# EAGLE design Adaptador_ESP12 (EAGLE 6.5.0)
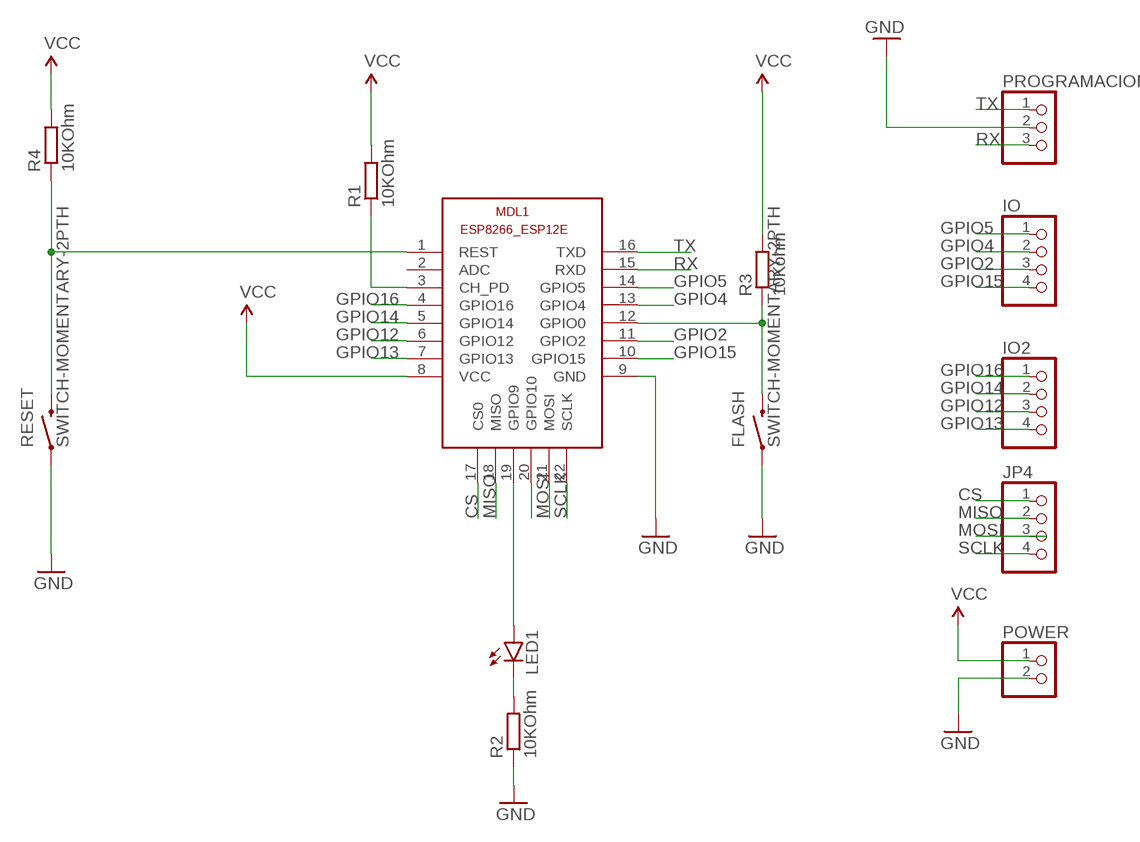
[diagram p0: schematic, sheet 1]

## Parts
FLASH  SWITCH-MOMENTARY-2PTH  [TACTILE-PTH]
IO  PINHD-1X4  [1X04]
IO2  PINHD-1X4  [1X04]
JP4  PINHD-1X4  [1X04]
LED1  LED-3MM-NO_SILK  [LED3MM-NS]
MDL1  ESP8266-12EESP8266-ESP12E  [ESP8266-ESP12E]
POWER  PINHD-1X2  [1X02]
PROGRAMACION  PINHD-1X3  [1X03]
R1  10KOhm  R-EU_0207/7  [0207/7]
R2  10KOhm  R-EU_0207/7  [0207/7]
R3  10Kohm  R-EU_0207/7  [0207/7]
R4  10KOhm  R-EU_0207/7  [0207/7]
RESET  SWITCH-MOMENTARY-2PTH  [TACTILE-PTH]

## Nets
CS: JP4.1 MDL1.17(CS0)
GND: FLASH.1 MDL1.9(GND) POWER.2 PROGRAMACION.2 R2.1 RESET.1
GPIO2: IO.3 MDL1.11(GPIO2)
GPIO4: IO.2 MDL1.13(GPIO4)
GPIO5: IO.1 MDL1.14(GPIO5)
GPIO12: IO2.3 MDL1.6(GPIO12)
GPIO13: IO2.4 MDL1.7(GPIO13)
GPIO14: IO2.2 MDL1.5(GPIO14)
GPIO15: IO.4 MDL1.10(GPIO15)
GPIO16: IO2.1 MDL1.4(GPIO16)
MISO: JP4.2 MDL1.18(MISO)
MOSI: MDL1.21(MOSI)
N$1: FLASH.3 MDL1.12(GPIO0) R3.1
N$2: MDL1.1(REST) R4.1 RESET.3
N$3: MDL1.3(CH_PD) R1.1
N$4: LED1.K(C) R2.2
N$10: MDL1.20(GPIO10)
N$11: LED1.A MDL1.19(GPIO9)
RX: MDL1.15(RXD) PROGRAMACION.3
SCLK: JP4.4 MDL1.22(SCLK)
TX: MDL1.16(TXD) PROGRAMACION.1
VCC: MDL1.8(VCC) POWER.1 R1.2 R3.2 R4.2
Unconnected: JP4.3 MDL1.2(ADC)

## Library data of the parts
FLASH RESET = SparkFun-Electromechanical:SWITCH-MOMENTARY-2: Various NO switches- pushbuttons, reed, etc
IO IO2 JP4 = pinhead:PINHD-1X4: PIN HEADER
LED1 = SparkFun-LED:LED: LEDs Standard schematic elements and footprints for 5mm, 3mm, 1206, and 0603 sized LEDs. 5mm - Spark Fun Electronics SKU : COM-00529 (and others)
MDL1 = ESP8266-ESP12E:ESP8266-12E: ESP8266-12E with additional I/O and GPIO04/05 corrected The author cannot warrant that this library is free from error or will meet your specific requirements. Created by PuceBaboon.com. Komagane, Nagano, JAPAN
POWER = pinhead:PINHD-1X2: PIN HEADER
PROGRAMACION = pinhead:PINHD-1X3: PIN HEADER
R1-R4 = rcl:R-EU_: RESISTOR, European symbol

## Board
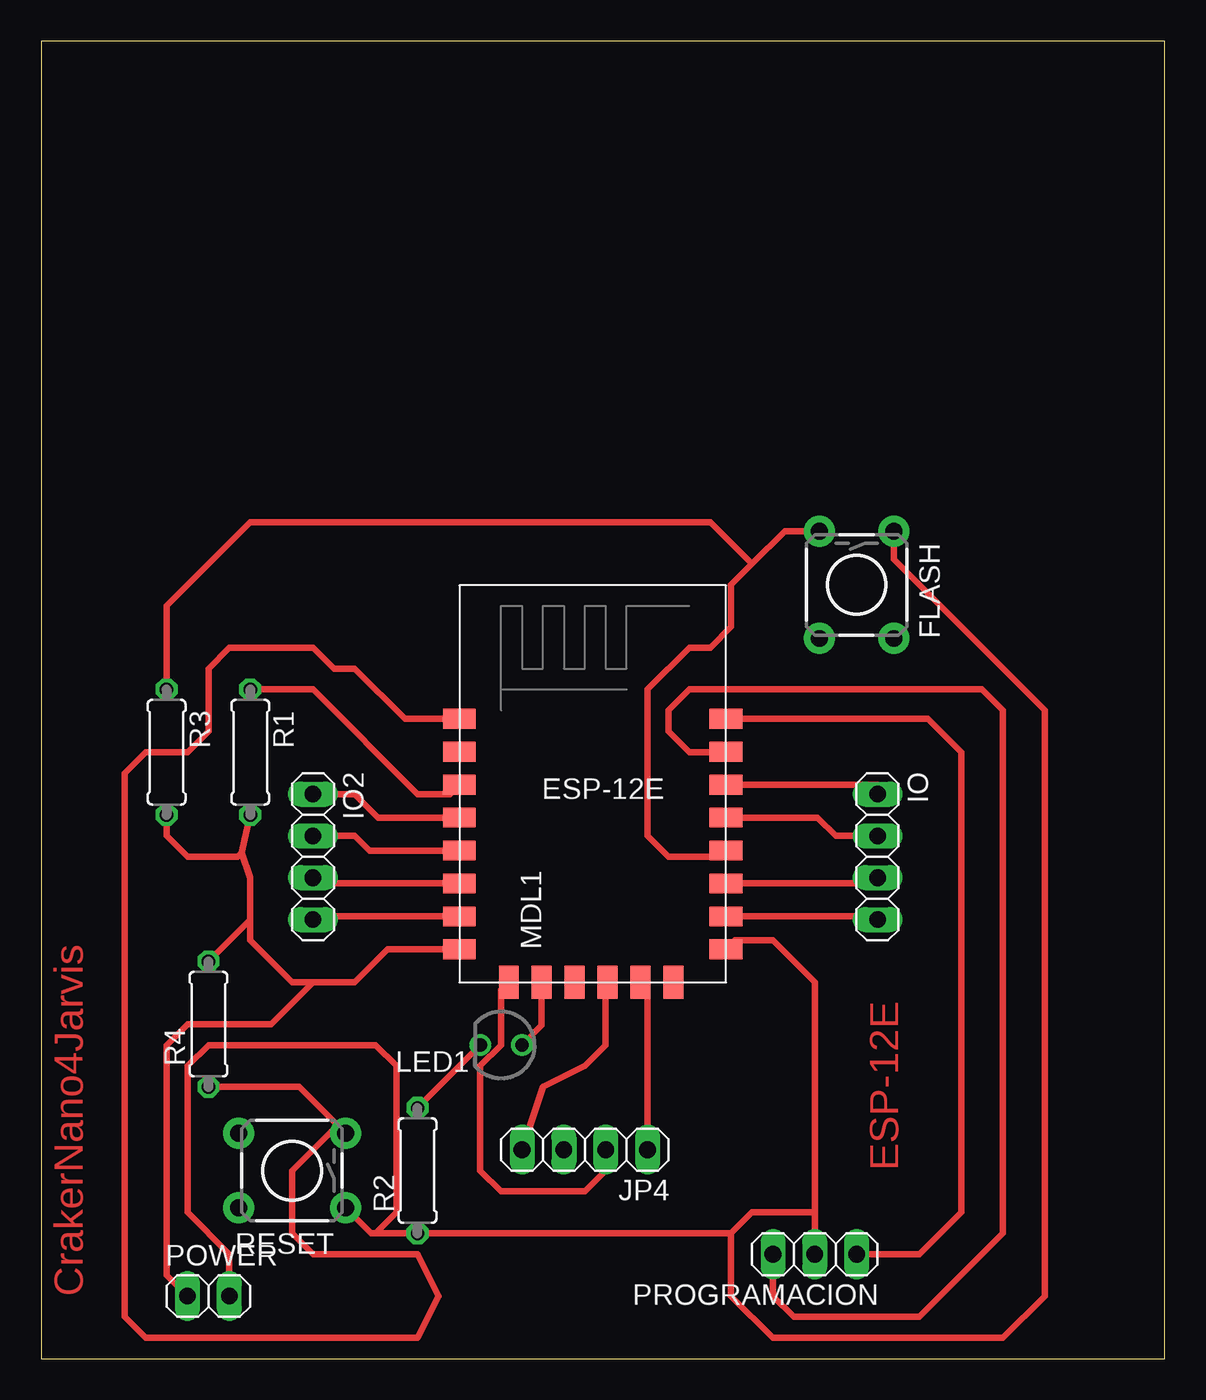
[diagram p1: board, top side]

Size 68.25 x 80 mm. Coordinates in mm from the lower left corner, seen from the top.
Outline: 0,0 68.25,0 68.25,80 0,80 0,0
Copper layers (1*16): Top 0.035mm / dielectric 1.5mm / Bottom 0.035mm
Design rules "default": minimum track width 10mil, minimum drill 24mil, track to track 8mil, track to pad 8mil, pad to pad 8mil, via to via 8mil, smd to smd 8mil, copper to edge 40mil, drill to drill 8mil, minimum pad ring 10mil, minimum via ring 8mil, stop-mask expansion 4mil, vias tented up to drill 0mil, thermal gap 10mil

### Footprints (pad centres in the part's own frame; a part is rotated, then mirrored left to right if it is on the bottom)
TACTILE-PTH = drill 1.016 pad 1.88: 1 -3.251,2.261; 2 3.251,2.261; 3 -3.251,-2.261; 4 3.251,-2.261
1X04 = drill 1.016 long: 1 -3.81,0; 2 -1.27,0; 3 1.27,0; 4 3.81,0
LED3MM-NS = drill 0.813: A -1.27,0; K 1.27,0
ESP8266-ESP12E = smd 2 x 1.2: 1 0,16; 2 0,14; 3 0,12; 4 0,10; 5 0,8; 6 0,6; 7 0,4; 8 0,2; 9 16.2,2; 10 16.2,4; 11 16.2,6; 12 16.2,8; 13 16.2,10; 14 16.2,12; 15 16.2,14; 16 16.2,16 | smd 1.2 x 2: 17 11,0; 18 3,0; 19 5,0; 20 13,0; 21 7,0; 22 9,0
1X02 = drill 1.016 long: 1 -1.27,0; 2 1.27,0
1X03 = drill 1.016 long: 1 -2.54,0; 2 0,0; 3 2.54,0
0207/7 = drill 0.813 octagon: 1 -3.81,0; 2 3.81,0

### Placement (x,y rotation side)
FLASH  49.53,46.99 270 top
IO  50.8,30.48 270 top
IO2  16.51,30.48 270 top
JP4  33.02,12.7 180 top
LED1  27.94,19.05 180 top
MDL1  25.4,22.86 0 top
POWER  10.16,3.81 0 top
PROGRAMACION  46.99,6.35 180 top
R1  12.7,36.83 270 top
R2  22.86,11.43 90 top
R3  7.62,36.83 270 top
R4  10.16,20.32 90 top
RESET  15.24,11.43 180 top

### Tracks (layer width: path | path; a pad name or v marks a point on that pad's centre or on a via)
CS
  Top 0.406: JP4.1 36.83,22.43 MDL1.17
GND
  Top 0.406: PROGRAMACION.2 46.99,8.89 | 46.99,8.89 46.99,22.86 44.45,25.4 42.14,25.4 MDL1.9 | FLASH.1 51.79,48.54 60.96,39.37 60.96,3.81 58.42,1.27 44.45,1.27 41.91,3.81 41.91,7.62 | 41.91,7.62 43.18,8.89 46.99,8.89 | 20.32,7.62 R2.1 41.91,7.62 | 20.32,7.62 20.04,7.62 RESET.1 | POWER.2 11.43,6.35 8.89,8.89 8.89,17.78 10.16,19.05 20.32,19.05 21.59,17.78 21.59,8.89 20.32,7.62
GPIO2
  Top 0.406: MDL1.11 50.45,28.86 IO.3
GPIO4
  Top 0.406: MDL1.13 47.15,32.86 48.26,31.75 IO.2
GPIO5
  Top 0.406: MDL1.14 50.8,34.86 IO.1
GPIO12
  Top 0.406: MDL1.6 16.86,28.86 IO2.3
GPIO13
  Top 0.406: MDL1.7 16.7,26.86 IO2.4
GPIO14
  Top 0.406: MDL1.5 19.94,30.86 19.05,31.75 IO2.2
GPIO15
  Top 0.406: MDL1.10 50.61,26.86 IO.4
GPIO16
  Top 0.406: MDL1.4 20.48,32.86 19.05,34.29 IO2.1
MISO
  Top 0.406: JP4.2 34.29,11.43 33.02,10.16 27.94,10.16 26.67,11.43 26.67,17.78 27.94,19.05 27.94,22.4 MDL1.18
N$1
  Top 0.406: FLASH.3 45.16,50.24 43.18,48.26 | 43.18,48.26 41.91,46.99 41.91,44.45 40.64,43.18 39.37,43.18 36.83,40.64 36.83,31.75 38.1,30.48 41.22,30.48 MDL1.12 | R3.1 7.62,45.72 12.7,50.8 40.64,50.8 43.18,48.26
N$2
  Top 0.406: R4.1 15.67,16.51 18,14.19 | 18,14.19 RESET.3 | MDL1.1 22.1,38.86 19.05,41.91 17.78,41.91 16.51,43.18 11.43,43.18 10.16,41.91 10.16,38.1 8.89,36.83 6.35,36.83 5.08,35.56 5.08,2.54 6.35,1.27 22.86,1.27 24.13,3.81 22.86,6.35 16.51,6.35 15.24,7.62 15.24,11.43 18,14.19
N$3
  Top 0.406: R1.1 16.51,40.64 22.86,34.29 24.83,34.29 MDL1.3
N$4
  Top 0.406: LED1.K R2.2
N$11
  Top 0.406: MDL1.19 30.4,20.24 LED1.A
RX
  Top 0.406: PROGRAMACION.3 44.45,3.81 45.72,2.54 53.34,2.54 58.42,7.62 58.42,39.37 57.15,40.64 39.37,40.64 38.1,39.37 38.1,38.1 39.37,36.83 41.57,36.83 MDL1.15
SCLK
  Top 0.406: JP4.4 30.48,16.51 33.02,17.78 34.29,19.05 34.29,22.75 MDL1.22
TX
  Top 0.406: MDL1.16 53.85,38.86 55.88,36.83 55.88,8.89 53.34,6.35 PROGRAMACION.1
VCC
  Top 0.406: MDL1.8 21.05,24.86 19.05,22.86 16.51,22.86 | 16.51,22.86 15.24,22.86 12.7,25.4 12.7,26.67 | 12.7,26.67 12.7,29.21 12.19,30.73 | 12.19,30.73 R1.2 | R4.2 12.7,26.67 | POWER.1 7.62,5.08 7.62,19.05 8.89,20.32 13.97,20.32 16.51,22.86 | R3.2 7.62,31.75 8.89,30.48 11.94,30.48 12.19,30.73

### Text on the board
Top: ESP-12E | CrakerNano4Jarvis